# EAGLE design recieving end copy (EAGLE 6.3)
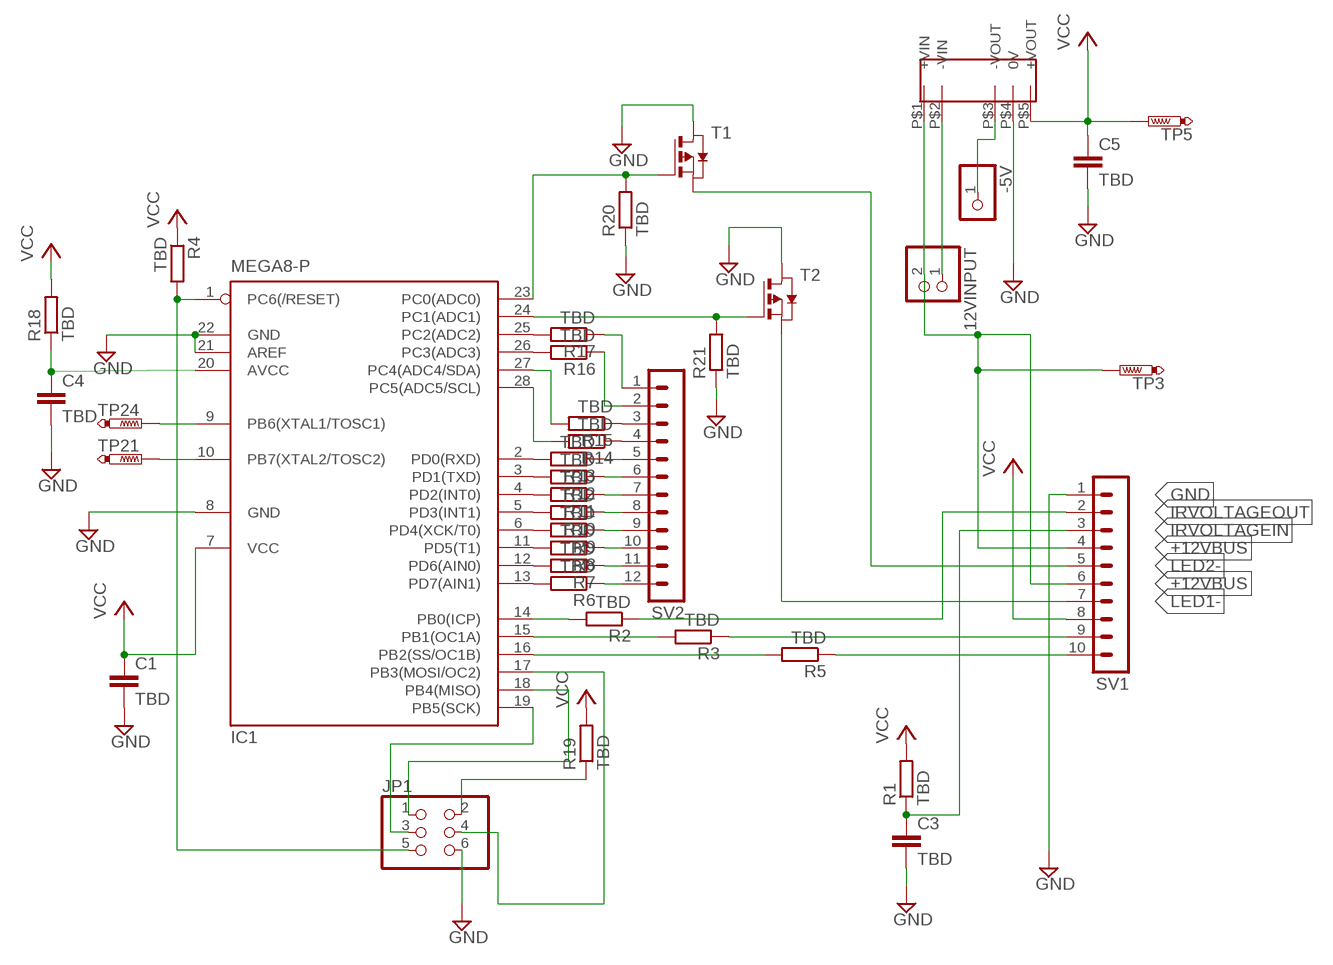
[diagram p0: schematic, sheet 1]

## Parts
12VINPUT  PINHD-1X2  [1X02]
-5V  PINHD-1X1  [1X01]
C1  TBD  C-EUC0805  [C0805]
C3  TBD  C-EUC0805  [C0805]
C4  TBD  C-EUC0805  [C0805]
C5  TBD  C-EUC0805  [C0805]
IC1  MEGA8-P  [DIL28-3]
JP1  PINHD-2X3  [2X03]
R1  TBD  R-EU_R0805  [R0805]
R2  TBD  R-EU_R0805  [R0805]
R3  TBD  R-EU_R0805  [R0805]
R4  TBD  R-EU_R0805  [R0805]
R5  TBD  R-EU_R0805  [R0805]
R6  TBD  R-EU_R0805  [R0805]
R7  TBD  R-EU_R0805  [R0805]
R8  TBD  R-EU_R0805  [R0805]
R9  TBD  R-EU_R0805  [R0805]
R10  TBD  R-EU_R0805  [R0805]
R11  TBD  R-EU_R0805  [R0805]
R12  TBD  R-EU_R0805  [R0805]
R13  TBD  R-EU_R0805  [R0805]
R14  TBD  R-EU_R0805  [R0805]
R15  TBD  R-EU_R0805  [R0805]
R16  TBD  R-EU_R0805  [R0805]
R17  TBD  R-EU_R0805  [R0805]
R18  TBD  R-EU_R0805  [R0805]
R19  TBD  R-EU_R0805  [R0805]
R20  TBD  R-EU_R0805  [R0805]
R21  TBD  R-EU_R0805  [R0805]
SV1  MA10-1  [MA10-1]
SV2  MA12-1  [MA12-1]
T1  PMOSSOT23ZXM61P02FTA  [SOT-23]
T2  PMOSSOT23ZXM61P02FTA  [SOT-23]
TP3  PTR1B1,27  [B1,27]
TP5  PTR1B1,27  [B1,27]
TP21  PTR1B1,27  [B1,27]
TP24  PTR1B1,27  [B1,27]
U$1  NKA1205SC  [NKA1205SC]

## Nets
0VBUS: 12VINPUT.1 U$1.P$2(-VIN)
+12VBUS: 12VINPUT.2 SV1.4 SV1.6 TP3.TP U$1.P$1(+VIN)
GND: C1.2 C3.2 C4.2 C5.2 IC1.8(GND) IC1.21(AREF) IC1.22(GND) JP1.6 R20.1 R21.1 SV1.1 T1.1(D) T2.1(D) U$1.P$4(0V)
IRVOLTAGEIN: C3.1 R1.1 SV1.3
IRVOLTAGEOUT: R2.1 SV1.2
LED1-: SV1.7 T2.2(S)
LED2-: SV1.5 T1.2(S)
N$1: IC1.24(PC1(ADC1)) R21.2 T2.3(G)
N$2: R3.1 SV1.9
N$3: R17.1 SV2.1
N$4: R16.1 SV2.2
N$5: IC1.17(PB3(MOSI/OC2)) JP1.4
N$6: IC1.27(PC4(ADC4/SDA)) R15.2
N$7: IC1.28(PC5(ADC5/SCL)) R14.2
N$8: IC1.23(PC0(ADC0)) R20.2 T1.3(G)
N$9: R5.1 SV1.10
N$10: R13.1 SV2.5
N$11: IC1.14(PB0(ICP)) R2.2
N$12: R12.1 SV2.6
N$13: R11.1 SV2.7
N$14: R10.1 SV2.8
N$15: R9.1 SV2.9
N$16: R8.1 SV2.10
N$17: R7.1 SV2.11
N$18: IC1.15(PB1(OC1A)) R3.2
N$19: IC1.16(PB2(SS/OC1B)) R5.2
N$22: R6.1 SV2.12
N$23: IC1.25(PC2(ADC2)) R17.2
N$24: IC1.26(PC3(ADC3)) R16.2
N$25: R15.1 SV2.3
N$26: R14.1 SV2.4
N$27: IC1.2(PD0(RXD)) R13.2
N$28: IC1.6(PD4(XCK/T0)) R9.2
N$29: IC1.18(PB4(MISO)) JP1.1
N$30: IC1.19(PB5(SCK)) JP1.3
N$31: IC1.9(PB6(XTAL1/TOSC1)) TP24.TP
N$32: IC1.10(PB7(XTAL2/TOSC2)) TP21.TP
N$33: IC1.11(PD5(T1)) R8.2
N$34: IC1.12(PD6(AIN0)) R7.2
N$35: IC1.1(PC6(/RESET)) JP1.5 R4.2
N$36: IC1.13(PD7(AIN1)) R6.2
N$37: IC1.3(PD1(TXD)) R12.2
N$38: IC1.4(PD2(INT0)) R11.2
N$39: IC1.5(PD3(INT1)) R10.2
N$41: C4.1 IC1.20(AVCC) R18.1
N$43: JP1.2 R19.1
N$46: -5V.1 U$1.P$3(-VOUT)
VCC: C1.1 C5.1 IC1.7(VCC) R1.2 R4.1 R18.2 R19.2 SV1.8 TP5.TP U$1.P$5(+VOUT)

## Library data of the parts
12VINPUT = pinhead:PINHD-1X2: PIN HEADER
-5V = pinhead:PINHD-1X1: PIN HEADER
C1 C3-C5 = rcl:C-EU: CAPACITOR, European symbol
IC1 = atmel:MEGA8-P: MICROCONTROLLER 8 Kbytes FLASH, 1 kbytes SRAM, 512 bytes EEPROM, USART, 4-channel 10 bit ADC, 2-channel 8 bit ADC Pin compatible with Atmega48, ATMega88, ATMega168 Source: avr.lbr; OC_FARNELL: unknown; OC_NEWARK: unknown
JP1 = pinhead:PINHD-2X3: PIN HEADER
R1-R21 = resistor:R-EU_: RESISTOR, European symbol
SV1 = con-lstb:MA10-1: PIN HEADER; OC_FARNELL: unknown; OC_NEWARK: unknown
SV2 = con-lstb:MA12-1: PIN HEADER; OC_FARNELL: unknown; OC_NEWARK: unknown
T1 T2 = solomon_library:PMOSSOT23: MOS FET; OC_FARNELL: unknown; OC_NEWARK: unknown
TP3 TP5 TP21 TP24 = testpad:PTR1: TEST PIN
U$1 = nka1205sc:NKA1205SC

## Board
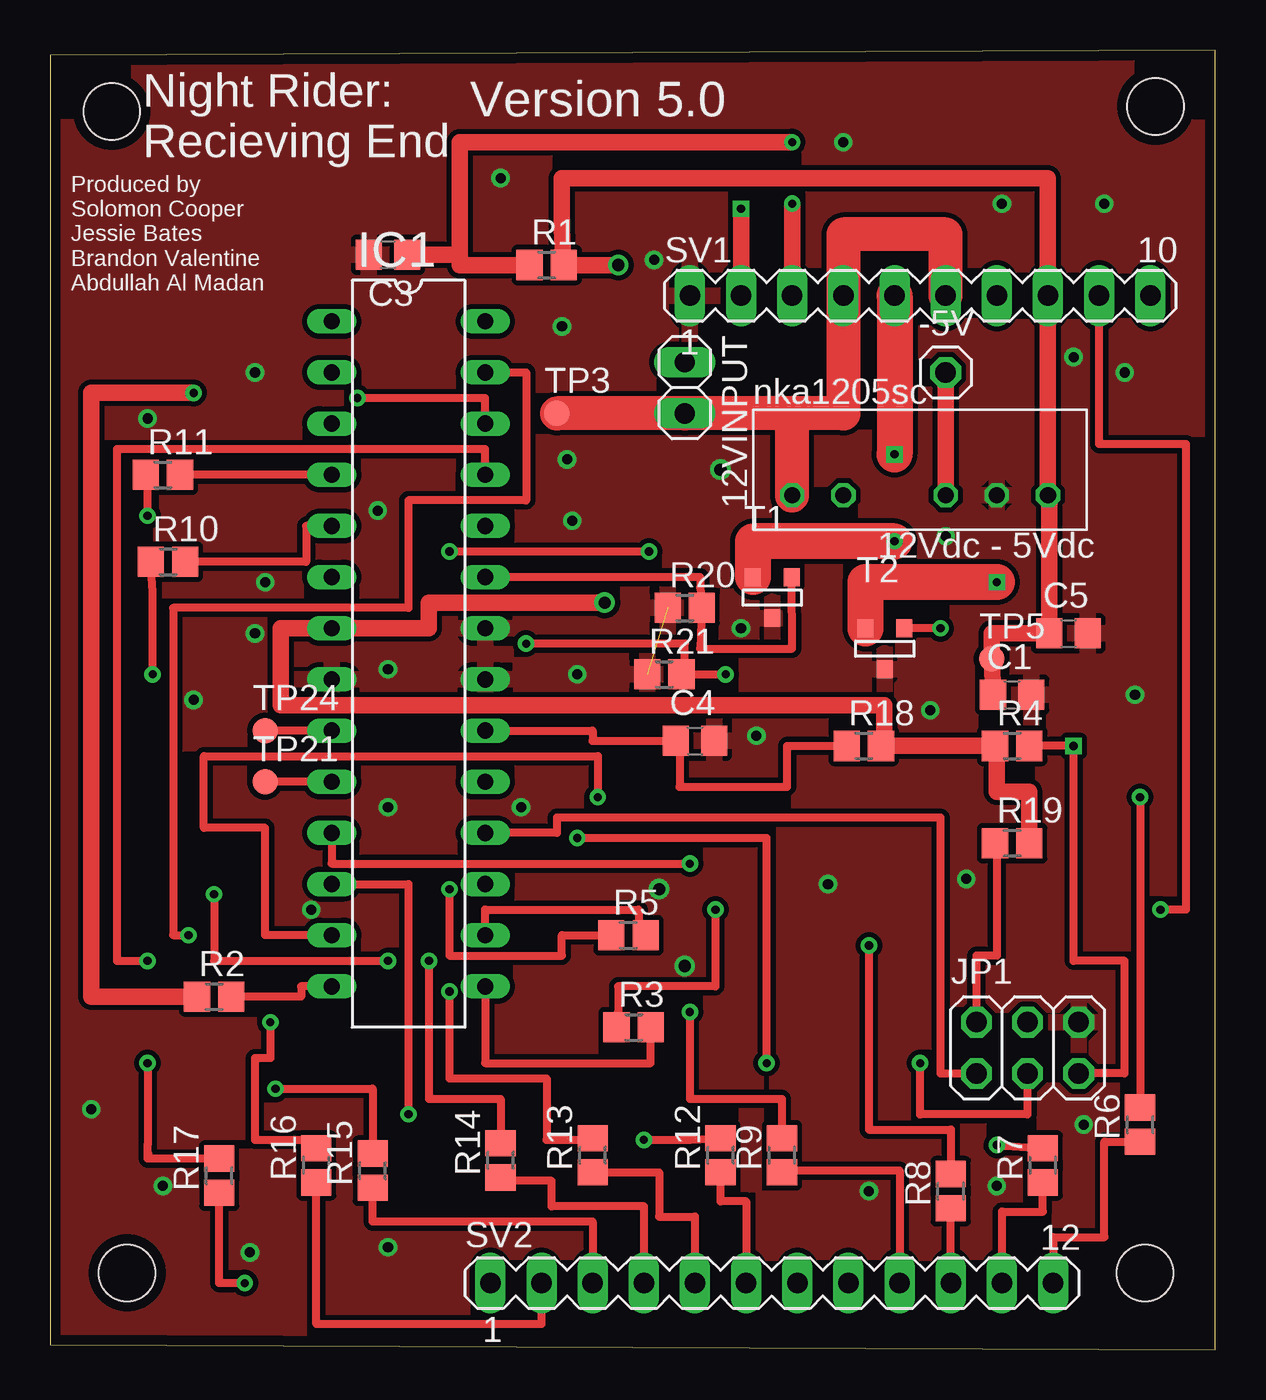
[diagram p1: board, top side]
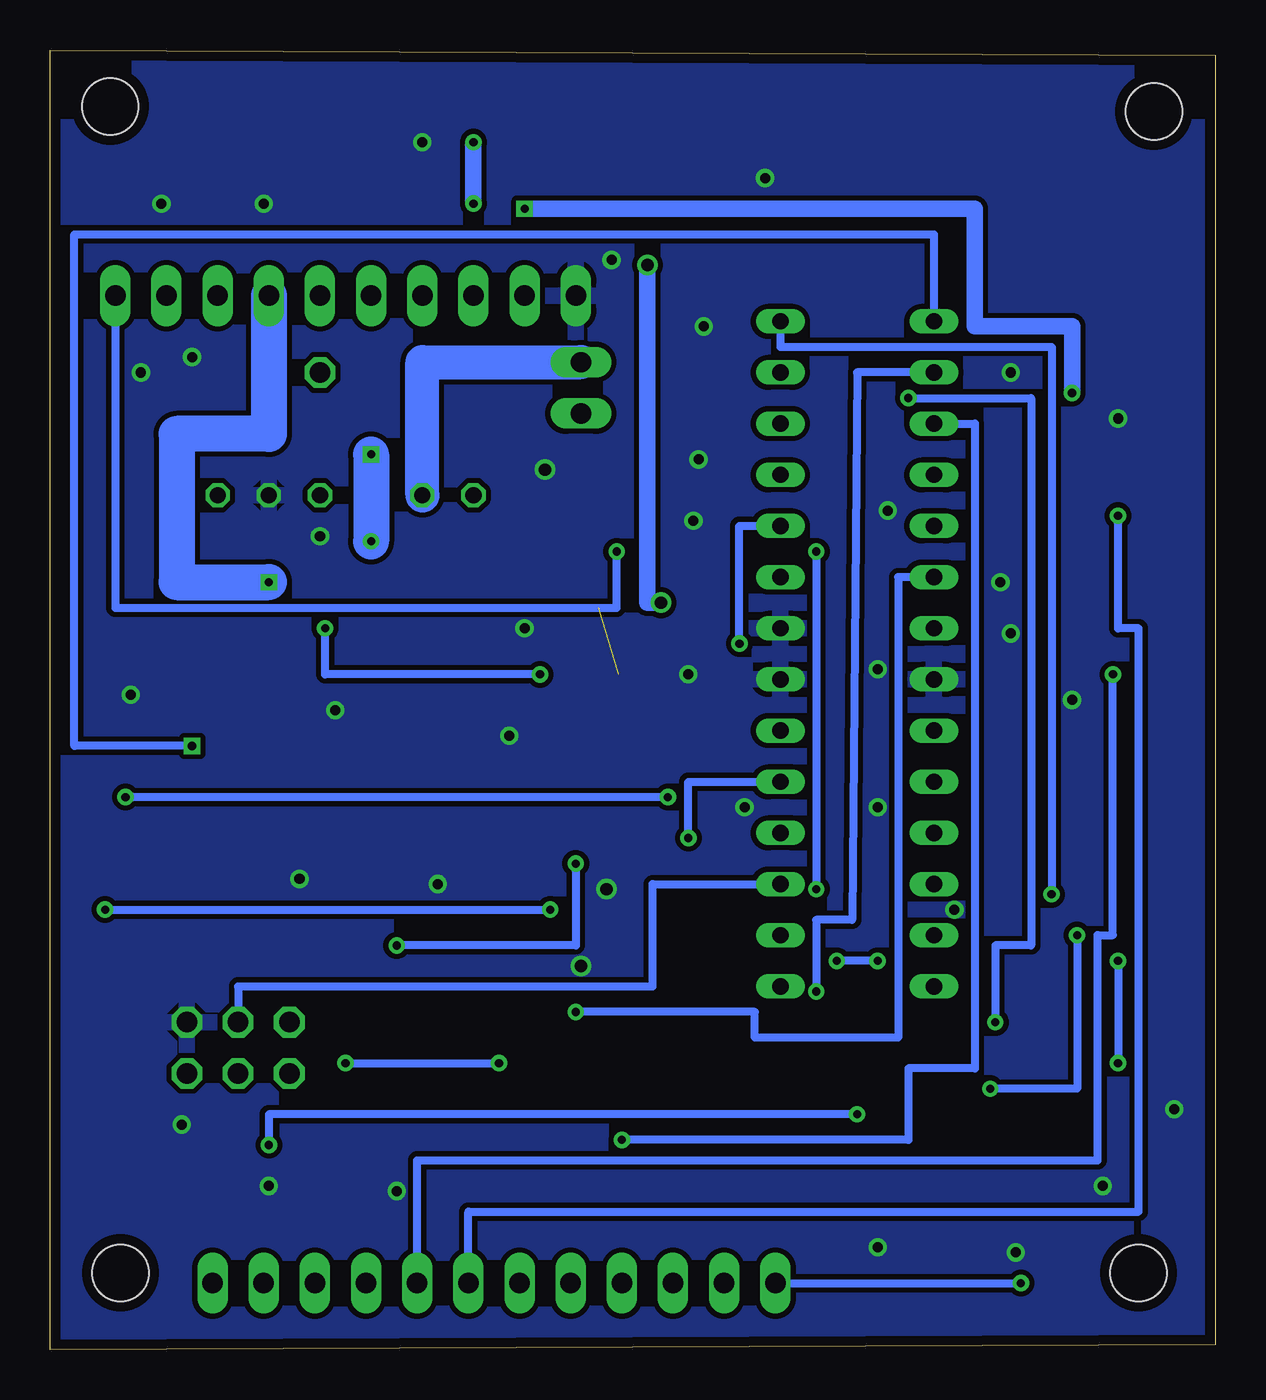
[diagram p2: board, bottom side, seen from below]

Size 57.84 x 64.51 mm. Coordinates in mm from the lower left corner, seen from the top.
Outline: 0,0.25 57.84,0 57.84,64.51 0,64.25 0,0.25
Copper layers (1*16): Top 0.0178mm / dielectric 59mil / Bottom 0.0178mm
Design rules "sunstone-valueproto": minimum track width 7mil, minimum drill 16mil, track to track 7mil, track to pad 7mil, pad to pad 7mil, via to via 7mil, smd to smd 7mil, copper to edge 20mil, drill to drill 16mil, minimum pad ring 8mil, minimum via ring 8mil, stop-mask expansion 3mil, vias tented up to drill 0mil, thermal gap 10mil
Holes 2.8 mm at 3.05,61.47 54.86,61.72 54.36,3.81 3.81,3.81

### Footprints (pad centres in the part's own frame; a part is rotated, then mirrored left to right if it is on the bottom)
1X02 = drill 1.016 long: 1 -1.27,0; 2 1.27,0
1X01 = drill 1.016 octagon: 1 0,0
C0805 = smd 1.3 x 1.5: 1 -0.95,0; 2 0.95,0
DIL28-3 = drill 0.813 long: 1 -16.51,-3.81; 2 -13.97,-3.81; 3 -11.43,-3.81; 4 -8.89,-3.81; 5 -6.35,-3.81; 6 -3.81,-3.81; 7 -1.27,-3.81; 8 1.27,-3.81; 9 3.81,-3.81; 10 6.35,-3.81; 11 8.89,-3.81; 12 11.43,-3.81; 13 13.97,-3.81; 14 16.51,-3.81; 15 16.51,3.81; 16 13.97,3.81; 17 11.43,3.81; 18 8.89,3.81; 19 6.35,3.81; 20 3.81,3.81; 21 1.27,3.81; 22 -1.27,3.81; 23 -3.81,3.81; 24 -6.35,3.81; 25 -8.89,3.81; 26 -11.43,3.81; 27 -13.97,3.81; 28 -16.51,3.81
2X03 = drill 1.016 octagon: 1 -2.54,-1.27; 2 -2.54,1.27; 3 0,-1.27; 4 0,1.27; 5 2.54,-1.27; 6 2.54,1.27
R0805 = smd 1.3 x 1.5: 1 -0.85,0; 2 0.85,0
MA10-1 = drill 1.016 long: 1 -11.43,0; 2 -8.89,0; 3 -6.35,0; 4 -3.81,0; 5 -1.27,0; 6 1.27,0; 7 3.81,0; 8 6.35,0; 9 8.89,0; 10 11.43,0
MA12-1 = drill 1.016 long: 1 -13.97,0; 2 -11.43,0; 3 -8.89,0; 4 -6.35,0; 5 -3.81,0; 6 -1.27,0; 7 1.27,0; 8 3.81,0; 9 6.35,0; 10 8.89,0; 11 11.43,0; 12 13.97,0
SOT-23 = smd 0.787 x 0.889: 1 0.025,-1.016; 2 -0.94,1.016; 3 0.991,1.016
B1,27 = smd 1.27 x 1.27: TP 0,0
NKA1205SC = drill 0.8 octagon: P$1 -6.35,-1.27; P$2 -3.81,-1.27; P$3 1.27,-1.27; P$4 3.81,-1.27; P$5 6.35,-1.27

### Placement (x,y rotation side)
12VINPUT  31.5,47.75 270 top
-5V  44.45,48.51 0 top
C1  47.75,32.51 0 top
C3  16.76,54.36 180 top
C4  32,30.23 0 top
C5  50.55,35.56 0 top
IC1  17.78,34.54 270 top
JP1  48.51,14.99 0 top
R1  24.64,53.85 0 top
R2  8.13,17.53 0 top
R3  28.96,16 0 top
R4  47.75,29.97 0 top
R5  28.7,20.57 0 top
R6  54.1,11.18 90 top
R7  49.28,9.14 90 top
R8  44.7,7.87 90 top
R9  36.32,9.65 90 top
R10  5.84,39.12 0 top
R11  5.59,43.43 0 top
R12  33.27,9.65 90 top
R13  26.92,9.65 90 top
R14  22.35,9.4 90 top
R15  16,8.89 90 top
R16  13.21,9.14 90 top
R17  8.38,8.64 90 top
R18  40.39,29.97 0 top
R19  47.75,25.15 0 top
R20  31.5,36.83 0 top
R21  30.48,33.53 0 top
SV1  43.18,52.32 0 top
SV2  35.81,3.3 0 top
T1  35.81,37.34 0 top
T2  41.4,34.8 0 top
TP3  25.15,46.48 0 top
TP5  46.74,34.29 0 top
TP21  10.67,28.19 0 top
TP24  10.67,30.73 0 top
U$1  43.18,43.69 0 top

### Tracks (layer width: path | path; a pad name or v marks a point on that pad's centre or on a via)
0VBUS
  Bottom 1.676: U$1.P$2 39.37,49.02 12VINPUT.1
+12VBUS
  Top 1.676: U$1.P$1 36.83,46.48 | 36.83,46.48 12VINPUT.2 TP3.TP | 36.83,46.48 39.37,46.48 SV1.4 39.37,55.37 44.45,55.37 SV1.6
GND  (via drill 0.5, 0.61)  (1 unrouted)
  other vias: 39.37,59.94 4.83,46.23 52.32,56.9 44.45,40.39 53.34,48.51 25.65,44.2 47.24,56.9 33.27,43.69 50.8,49.28 22.35,58.17 2.03,11.94 34.29,35.81 10.16,48.51 25.91,41.15 43.69,31.75 35.05,30.48 38.61,23.11 53.85,32.51 26.16,33.53 45.47,23.37 23.37,26.92 10.67,38.1 10.16,35.56 7.11,32.26 31.5,19.05 12.95,21.84 46.99,8.13 40.64,7.87 16.76,5.08 9.91,4.83 5.59,8.13 51.31,11.18 29.97,54.1 25.4,50.8 16.76,33.78 16.76,26.92 16.26,41.66 30.23,22.86
  pour Bottom (isolate 0.254): 0,0.25 57.66,0 57.91,64.52 0,64.26
  pour Top (isolate 0.254): 0,0.25 57.66,0 57.91,64.52 0,64.26
IRVOLTAGEIN  (via drill 0.41)
  Top 0.178: 23.88,54.36 23.79,54.36 R1.1
  Top 0.813: SV1.3 v36.83,56.9 | v36.83,59.94 20.32,59.94 20.32,54.36 | C3.1 20.32,54.36 | 20.32,54.36 20.32,53.85 R1.1
  Bottom 0.813: v36.83,56.9 v36.83,59.94
IRVOLTAGEOUT  (via drill 0.41)
  Top 0.813: SV1.2 v34.29,56.64 | v7.11,47.5 2.03,47.5 2.03,17.53 R2.1
  Bottom 0.813: v34.29,56.64 11.94,56.64 11.94,50.8 7.11,50.8 v7.11,47.5
LED1-  (via drill 0.41)
  Top 1.778: v46.99,38.1 40.46,38.1 T2.2
  Bottom 1.778: SV1.7 46.99,45.97 46.99,45.47 51.56,45.47 51.56,38.1 v46.99,38.1
LED2-  (via drill 0.41)
  Top 1.778: SV1.5 v41.91,44.45 | v41.91,40.13 34.87,40.13 T1.2
  Bottom 1.778: v41.91,44.45 v41.91,40.13
N$1  (via drill 0.41)
  Top 0.406: v23.62,35.05 31.5,35.05 31.5,33.27 R21.2 v33.53,33.53 | v44.2,35.81 T2.3
  Bottom 0.406: IC1.24 23.62,40.89 v23.62,35.05 | v33.53,33.53 44.2,33.53 v44.2,35.81
N$2  (via drill 0.41)
  Top 0.406: v33.02,21.84 33.02,18.03 28.19,18.03 28.19,16.76 R3.1 | v55.12,21.84 56.39,21.84 56.39,44.96 52.07,44.96 SV1.9
  Bottom 0.406: v55.12,21.84 v33.02,21.84
N$3  (via drill 0.41)
  Top 0.406: v9.65,3.3 8.38,3.3 R17.1
  Bottom 0.406: SV2.1 v9.65,3.3
N$4
  Top 0.406: R16.1 13.21,1.27 24.38,1.27 SV2.2
N$5
  Bottom 0.406: IC1.17 27.94,23.11 27.94,18.03 48.51,18.03 JP1.4
N$6  (via drill 0.41)
  Top 0.406: R15.2 16,12.95 v11.18,12.95 | v6.86,20.57 6.1,20.57 6.1,36.83 17.78,36.83 17.78,42.16 23.62,42.16 23.62,48.51 IC1.27
  Bottom 0.406: v6.86,20.57 6.86,12.95 v11.18,12.95
N$7  (via drill 0.41)
  Top 0.406: v18.8,19.3 18.8,12.45 22.35,12.45 R14.2 | v16.76,19.3 8.13,19.3 v8.13,22.61
  Bottom 0.406: v16.76,19.3 v18.8,19.3 | v8.13,22.61 8.13,49.78 21.59,49.78 IC1.28
N$8
  Top 0.406: T1.3 36.83,34.8 32.26,34.8 R20.2 32.26,37.85 32.26,38.35 IC1.23
N$9  (via drill 0.41)
  Top 0.178: 27.94,20.57 R5.1
  Top 0.406: R5.1 25.4,20.57 25.4,19.56 19.81,19.56 v19.81,22.86 | v29.72,39.62 v19.81,39.62
  Bottom 0.406: v19.81,39.62 v19.81,22.86 | SV1.10 54.61,36.83 29.72,36.83 v29.72,39.62
N$10
  Top 0.406: R13.1 30.23,8.8 30.23,6.6 32,6.6 SV2.5
N$11
  Top 0.406: IC1.14 12.45,18.03 12.45,17.53 R2.2
N$12
  Top 0.406: R12.1 33.27,7.37 34.54,7.37 SV2.6
N$13  (via drill 0.41)
  Top 0.406: v4.83,41.4 4.83,43.43 R11.1
  Bottom 0.406: v4.83,41.4 4.83,35.81 3.81,35.81 3.81,6.86 37.08,6.86 SV2.7
N$14  (via drill 0.41)
  Top 0.406: v5.08,33.53 5.08,37.59 R10.1
  Bottom 0.406: v5.08,33.53 5.08,20.57 5.84,20.57 5.84,9.4 39.62,9.4 SV2.8
N$15
  Top 0.406: R9.1 36.32,8.89 42.16,8.89 SV2.9
N$16
  Top 0.406: SV2.10 R8.1
N$17
  Top 0.406: R7.1 49.28,6.86 47.24,6.86 SV2.11
N$18
  Top 0.406: IC1.15 21.59,14.22 29.81,14.22 R3.2
N$19
  Top 0.178: 29.21,20.57 R5.2
  Top 0.406: 29.21,20.57 29.21,21.84 21.59,21.84 IC1.16
N$22
  Top 0.406: R6.1 52.32,10.33 52.32,5.59 49.78,5.59 SV2.12
N$23  (via drill 0.41)
  Top 0.178: 4.83,10.16 5.08,9.4
  Top 0.406: v4.83,14.22 4.83,10.16 4.83,9.49 R17.2 | v4.83,19.3 3.3,19.3 3.3,44.7 21.59,44.7 IC1.25
  Bottom 0.406: v4.83,19.3 v4.83,14.22
N$24  (via drill 0.41)
  Top 0.178: 12.7,10.41 R16.2
  Top 0.406: 12.7,10.41 10.16,10.41 10.16,14.48 10.92,14.48 v10.92,16.26 | v15.24,47.24 21.59,47.24 IC1.26
  Bottom 0.406: v10.92,16.26 10.92,20.07 9.14,20.07 9.14,47.24 v15.24,47.24
N$25
  Top 0.406: R15.1 16,6.35 26.92,6.35 SV2.3
N$26
  Top 0.406: R14.1 22.35,8.38 24.89,8.38 24.89,7.11 29.46,7.11 SV2.4
N$27  (via drill 0.41)
  Top 0.178: 26.67,10.41 R13.2
  Top 0.406: 26.67,10.41 24.64,10.41 24.64,13.46 19.81,13.46 v19.81,17.78
  Bottom 0.406: v19.81,17.78 19.81,21.34 18.03,21.34 17.78,48.51 IC1.2
N$28  (via drill 0.41)
  Top 0.406: v31.75,16.76 31.75,12.45 36.32,12.45 R9.2
  Bottom 0.406: v31.75,16.76 22.86,16.76 22.86,15.49 15.75,15.49 15.75,38.35 IC1.6
N$29
  Top 0.406: IC1.18 25.15,25.65 25.15,26.42 44.2,26.42 44.2,13.72 JP1.1
N$30  (via drill 0.41)
  Top 0.406: v26.16,25.4 35.56,25.4 v35.56,14.22 | v43.18,14.22 43.18,11.68 48.51,11.68 JP1.3
  Bottom 0.406: IC1.19 26.16,28.19 v26.16,25.4 | v43.18,14.22 v35.56,14.22
N$31
  Top 0.406: IC1.9 TP24.TP
N$32
  Top 0.406: IC1.10 TP21.TP
N$33  (via drill 0.41)
  Top 0.406: v40.64,20.07 40.64,10.92 44.7,10.92 R8.2 | v31.75,24.13 13.97,24.13 IC1.11
  Bottom 0.406: v40.64,20.07 31.75,20.07 v31.75,24.13
N$34  (via drill 0.41)
  Top 0.406: v17.78,11.68 17.78,23.11 IC1.12 | v46.99,10.16 R7.2
  Bottom 0.406: v46.99,10.16 46.99,11.68 v17.78,11.68
N$35  (via drill 0.41)
  Top 0.178: 48.51,29.97 R4.2
  Top 0.406: R4.2 v50.8,29.97 50.8,19.3 53.34,19.3 53.34,13.72 JP1.5
  Bottom 0.406: IC1.1 13.97,55.37 56.64,55.37 56.64,29.97 v50.8,29.97
N$36  (via drill 0.41)
  Top 0.406: v27.18,27.43 27.18,29.46 7.62,29.46 7.62,25.91 10.67,25.91 10.67,20.57 IC1.13 | v54.1,27.43 R6.2
  Bottom 0.406: v27.18,27.43 v54.1,27.43
N$37  (via drill 0.41)
  Top 0.406: v29.46,10.41 31.75,10.41 R12.2
  Bottom 0.406: v29.46,10.41 15.24,10.41 15.24,13.97 11.94,13.97 11.94,45.97 IC1.3
N$38
  Top 0.406: IC1.4 R11.2
N$39
  Top 0.406: R10.2 12.7,39.12 12.7,40.89 IC1.5
N$41
  Top 0.406: IC1.20 26.92,30.73 26.92,30.23 C4.1 31.24,30.23 31.24,27.94 36.58,27.94 36.58,29.97 R18.1
N$43
  Top 0.406: R19.1 46.99,25.15 46.99,19.56 45.97,19.56 45.97,18.54 JP1.2
N$46
  Top 0.813: U$1.P$3 -5V.1
VCC  (via drill 0.61)
  Top 0.813: C1.1 TP5.TP 46.74,35.56 C5.1 49.6,42.42 U$1.P$5 SV1.8 49.53,58.17 25.4,58.17 25.4,55.63 R1.2 v28.19,53.85 | 41.4,29.97 R4.1 46.99,29.97 46.99,27.69 48.6,27.69 R19.2 | R18.2 41.4,29.97 | 41.4,29.97 41.4,32 11.43,32 11.43,35.81 IC1.7 18.8,35.81 18.8,37.08 v27.52,37.08
  Bottom 0.813: v28.19,53.85 28.19,37.08 v27.52,37.08

### Text on the board
tPlace: Version 5.0 | Night Rider: / Recieving End | Produced by / Solomon Cooper / Jessie Bates / Brandon Valentine / Abdullah Al Madan